# Altium project 正负开关电源.PrjPcb
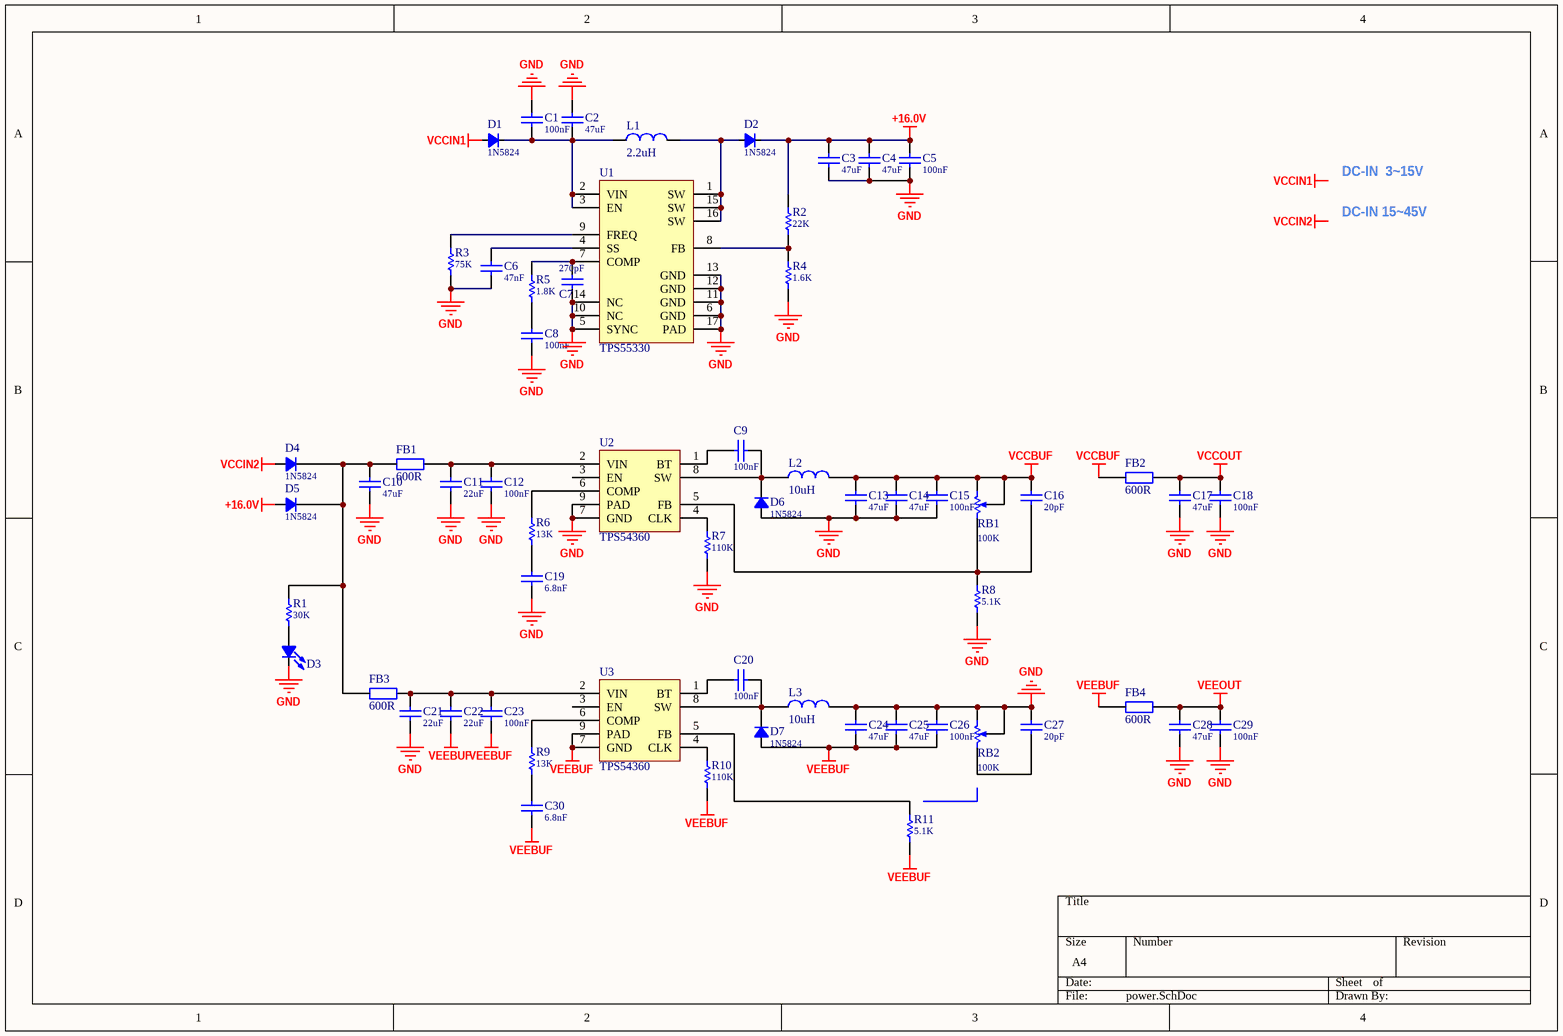
[diagram p0: power.SchDoc]
2 sheets, 66 parts. Net scope: global (net labels, ports and power ports of the same name join across sheets).
Board file: 正负开关电源.PcbDoc
Sheets:
  power.SchDoc
  ports.SchDoc

## Sheet power.SchDoc
size A4

### Parts
C1  value 100nF  [C0603-L]  (hidden comment: Cap-S)
C2  value 47uF  [C1206-L]  (hidden comment: Cap-S)
C3  value 47uF  [C1206-L]  (hidden comment: Cap-S)
C4  value 47uF  [C1206-L]  (hidden comment: Cap-S)
C5  value 100nF  [C0603-L]  (hidden comment: Cap-S)
C6  value 47nF  [C0603-L]  (hidden comment: Cap-S)
C7  value 270pF  [C0603-L]  (hidden comment: Cap-S)
C8  value 100nF  [C0603-L]  (hidden comment: Cap-S)
C9  value 100nF  [C0603-L]  (hidden comment: Cap-S)
C10  value 47uF  [C1206-L]  (hidden comment: Cap-S)
C11  value 22uF  [C1206-L]  (hidden comment: Cap-S)
C12  value 100nF  [C0603-L]  (hidden comment: Cap-S)
C13  value 47uF  [C1206-L]  (hidden comment: Cap-S)
C14  value 47uF  [C1206-L]  (hidden comment: Cap-S)
C15  value 100nF  [C0603-L]  (hidden comment: Cap-S)
C16  value 20pF  [C0603-L]  (hidden comment: Cap-S)
C17  value 47uF  [C1206-L]  (hidden comment: Cap-S)
C18  value 100nF  [C0603-L]  (hidden comment: Cap-S)
C19  value 6.8nF  [C0603-L]  (hidden comment: Cap-S)
C20  value 100nF  [C0603-L]  (hidden comment: Cap-S)
C21  value 22uF  [C1206-L]  (hidden comment: Cap-S)
C22  value 22uF  [C1206-L]  (hidden comment: Cap-S)
C23  value 100nF  [C0603-L]  (hidden comment: Cap-S)
C24  value 47uF  [C1206-L]  (hidden comment: Cap-S)
C25  value 47uF  [C1206-L]  (hidden comment: Cap-S)
C26  value 100nF  [C0603-L]  (hidden comment: Cap-S)
C27  value 20pF  [C0603-L]  (hidden comment: Cap-S)
C28  value 47uF  [C1206-L]  (hidden comment: Cap-S)
C29  value 100nF  [C0603-L]  (hidden comment: Cap-S)
C30  value 6.8nF  [C0603-L]  (hidden comment: Cap-S)
D1  Model: 1N5824  [D-SMA]  (hidden comment: D)
D2  Model: 1N5824  [D-SMA]  (hidden comment: D)
D3  LED  [Led-0805_M]  (value not drawn)
D4  Model: 1N5824  [D-SMA]  (hidden comment: D)
D5  Model: 1N5824  [D-SMA]  (hidden comment: D)
D6  Model: 1N5824  [D-SMA]  (hidden comment: D)
D7  Model: 1N5824  [D-SMA]  (hidden comment: D)
FB1  600R  [FB-0805]
FB2  600R  [FB-0805]
FB3  600R  [FB-0805]
FB4  600R  [FB-0805]
L1  2.2uH  [L-6.5mm]
L2  10uH  [L-6.5mm]
L3  10uH  [L-6.5mm]
R1  value 30K  [R0603-L]  (hidden comment: R)
R2  value 22K  [R0603-L]  (hidden comment: R)
R3  value 75K  [R0603-L]  (hidden comment: R)
R4  value 1.6K  [R0603-L]  (hidden comment: R)
R5  value 1.8K  [R0603-L]  (hidden comment: R)
R6  value 13K  [R0603-L]  (hidden comment: R)
R7  value 110K  [R0603-L]  (hidden comment: R)
R8  value 5.1K  [R0603-L]  (hidden comment: R)
R9  value 13K  [R0603-L]  (hidden comment: R)
R10  value 110K  [R0603-L]  (hidden comment: R)
R11  value 5.1K  [R0603-L]  (hidden comment: R)
RB1  value 100K  [R_VR-3296W]  (hidden comment: R)
RB2  value 100K  [R_VR-3296W]  (hidden comment: R)
U1  TPS55330  [VQFN-16]
U2  TPS54360  [SOP-8 with pad]
U3  TPS54360  [SOP-8 with pad]

### Nets
+16.0V: C3.2 C4.2 C5.2 D2.2(K) D5.1(A) R2.2
GND: C1.2 C2.2 C3.1 C4.1 C5.1 C6.1 C7.1 C8.1 C10.1 C11.1 C12.1 C13.1 C14.1 C15.1 C17.1 C18.1 C19.1 C21.1 C24.2 C25.2 C26.2 C27.2 C28.1 C29.1 D3.2 D6.1(A) L3.2 R3.2 R4.1 R7.1 R8.1 RB2.2 RB2.3 U1.5(SYNC) U1.6(GND) U1.10(NC) U1.11(GND) U1.12(GND) U1.13(GND) U1.14(NC) U1.17(PAD) U2.7(GND) U2.9(PAD)
VCCBUF: C13.2 C14.2 C15.2 C16.2 FB2.1 L2.2 RB1.2 RB1.3
VCCIN1: D1.1(A)
VCCIN2: D4.1(A)
VCCOUT: C17.2 C18.2 FB2.2
VEEBUF: C22.1 C23.1 C24.1 C25.1 C26.1 C30.1 D7.1(A) FB4.1 R10.1 R11.1 U3.7(GND) U3.9(PAD)
VEEOUT: C28.2 C29.2 FB4.2
NetC1_1: C1.1 C2.1 D1.2(K) L1.1 U1.2(VIN) U1.3(EN)
NetC6_2: C6.2 U1.4(SS)
NetC7_2: C7.2 R5.1 U1.7(COMP)
NetC8_2: C8.2 R5.2
NetC9_1: C9.1 U2.1(BT)
NetC9_2: C9.2 D6.2(K) L2.1 U2.8(SW)
NetC10_2: C10.2 D4.2(K) D5.2(K) FB1.1 FB3.1 R1.2
NetC11_2: C11.2 C12.2 FB1.2 U2.2(VIN)
NetC16_1: C16.1 R8.2 RB1.1 U2.5(FB)
NetC19_2: C19.2 R6.1
NetC20_1: C20.1 U3.1(BT)
NetC20_2: C20.2 D7.2(K) L3.1 U3.8(SW)
NetC21_2: C21.2 C22.2 C23.2 FB3.2 U3.2(VIN)
NetC27_1: C27.1 RB2.1
NetC30_2: C30.2 R9.1
NetD2_1: D2.1(A) L1.2 U1.1(SW) U1.15(SW) U1.16(SW)
NetD3_1: D3.1 R1.1
NetR2_1: R2.1 R4.2 U1.8(FB)
NetR3_1: R3.1 U1.9(FREQ)
NetR6_2: R6.2 U2.6(COMP)
NetR7_2: R7.2 U2.4(CLK)
NetR9_2: R9.2 U3.6(COMP)
NetR10_2: R10.2 U3.4(CLK)
NetR11_2: R11.2 U3.5(FB)

Not connected (* = marked no-connect by the designer): U2 3(EN); U3 3(EN)

### Notes on the sheet
- DC-IN  3~15V
- DC-IN 15~45V
- Labels drawn without touching a wire or pin: VCCIN1, VCCIN2

### Library data of the parts
C1-C30 = Cap-S: 贴片瓷片电容
D1 D2 D4-D7 = Diode: 二极管
D3 = LED: 发光二极管
FB1-FB4 = FB
L1-L3 = Inductor
R1-R11 = Res: 贴片电阻
RB1 RB2 = Res_Val: 可调电阻
U2 U3 = TPS54560

## Sheet ports.SchDoc
size A4
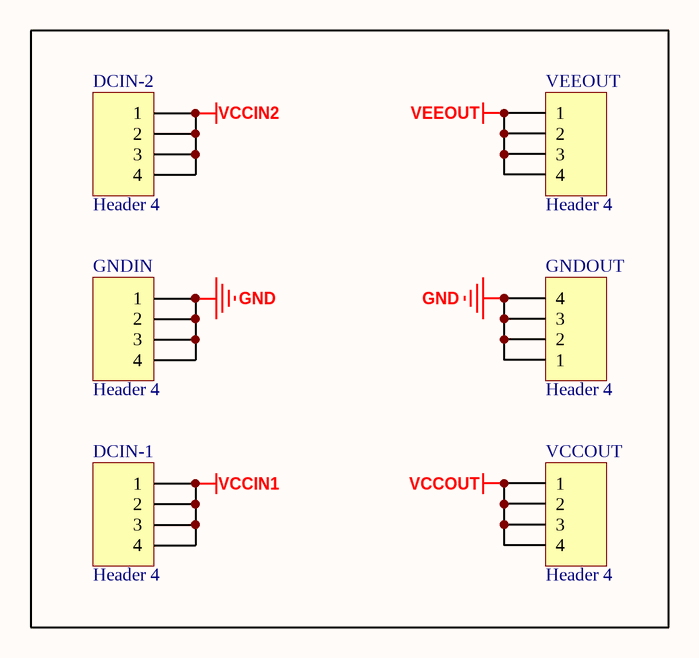
[diagram p1: ports.SchDoc]

### Parts
DCIN-1  Header 4  [HDR1X4]
DCIN-2  Header 4  [HDR1X4]
GNDIN  Header 4  [HDR1X4]
GNDOUT  Header 4  [HDR1X4]
VCCOUT  Header 4  [HDR1X4]
VEEOUT  Header 4  [HDR1X4]

### Nets
GND: GNDIN.1 GNDIN.2 GNDIN.3 GNDIN.4 GNDOUT.1 GNDOUT.2 GNDOUT.3 GNDOUT.4
VCCIN1: DCIN-1.1 DCIN-1.2 DCIN-1.3 DCIN-1.4
VCCIN2: DCIN-2.1 DCIN-2.2 DCIN-2.3 DCIN-2.4
VCCOUT: VCCOUT.1 VCCOUT.2 VCCOUT.3 VCCOUT.4
VEEOUT: VEEOUT.1 VEEOUT.2 VEEOUT.3 VEEOUT.4

### Library data of the parts
DCIN-1 DCIN-2 GNDIN GNDOUT VCCOUT VEEOUT = Header 4: Header, 4-Pin; LatestRevisionDate: 17-Jul-2002; LatestRevisionNote: Re-released for DXP Platform.; Publisher: Altium Limited

## Nets that join several sheets
GND: power (43 pins), ports (8 pins)
VCCIN1: power (D1.1), ports (DCIN-1.1 DCIN-1.2 DCIN-1.3 DCIN-1.4)
VCCIN2: power (D4.1), ports (DCIN-2.1 DCIN-2.2 DCIN-2.3 DCIN-2.4)
VCCOUT: power (C17.2 C18.2 FB2.2), ports (VCCOUT.1 VCCOUT.2 VCCOUT.3 VCCOUT.4)
VEEOUT: power (C28.2 C29.2 FB4.2), ports (VEEOUT.1 VEEOUT.2 VEEOUT.3 VEEOUT.4)